# EAGLE design riffleito-REVD (EAGLE 6.5.0)
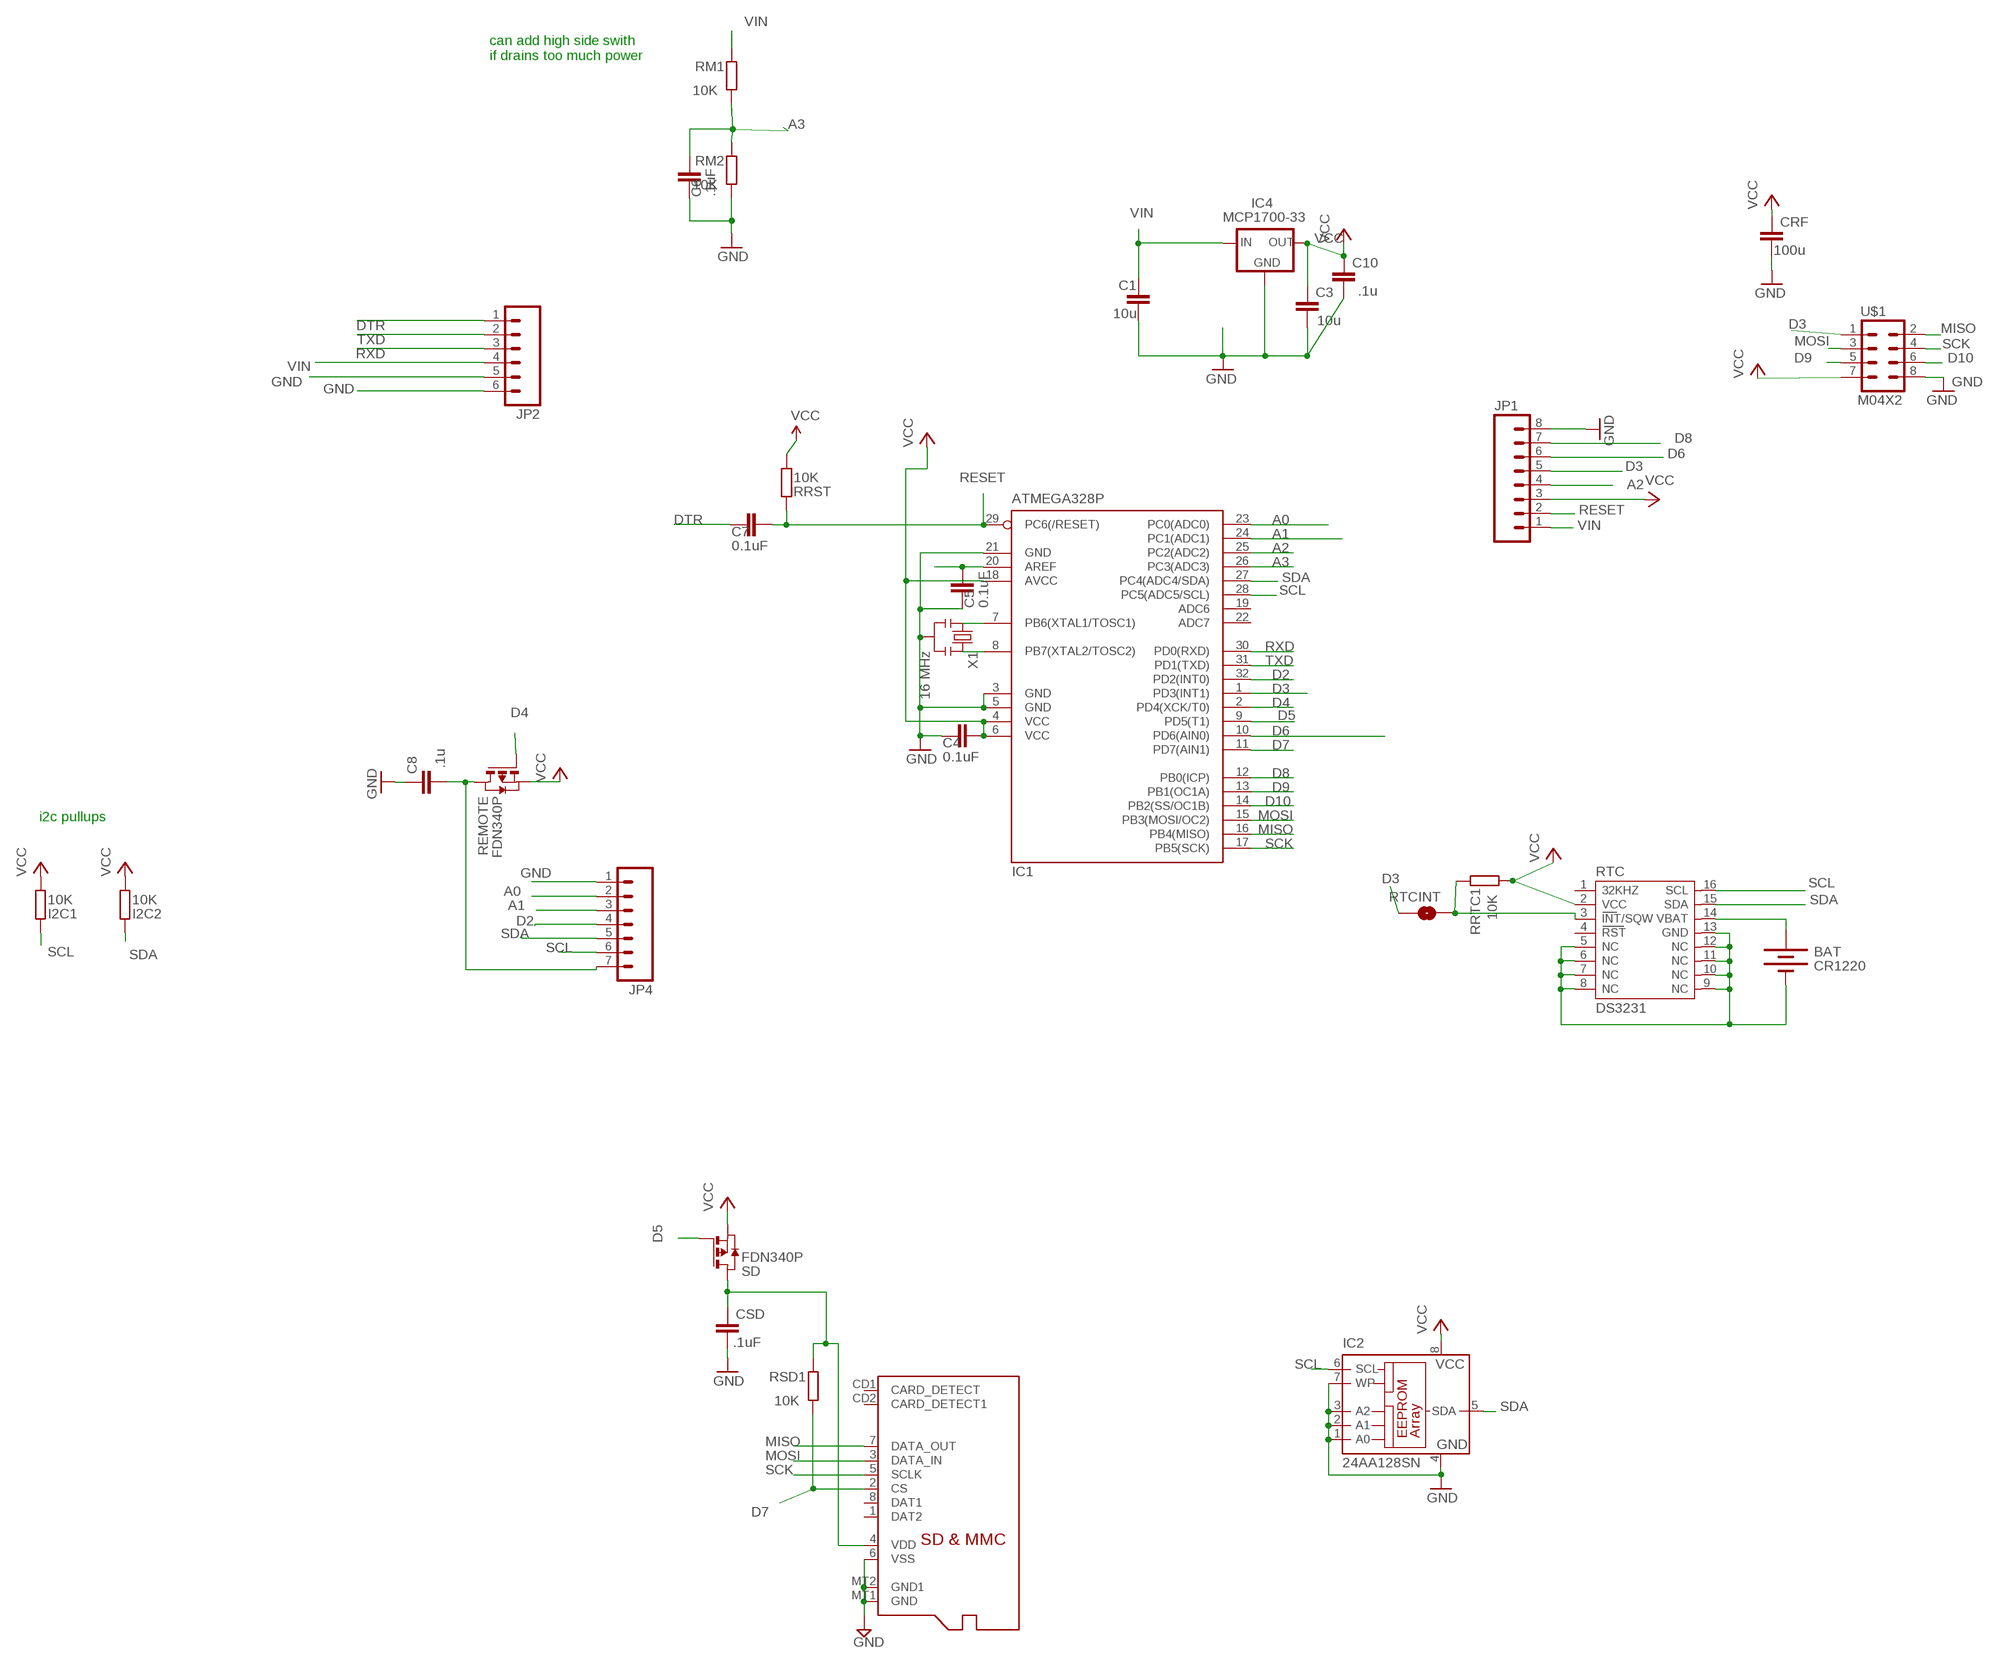
[diagram p0: schematic, sheet 1]

## Parts
BAT  CR1220  BATTERYBATTERY_12MM_SMT  [BATTCON_12MM_SMT]
C1  10u  C-EUC0805  [C0805]
C3  10u  C-EUC0805  [C0805]
C4  0.1uF  C-EUC0805  [C0805@1]
C5  0.1uF  C-EUC0805  [C0805@1]
C6  .1uF  C-EUC0805  [C0805@1]
C7  0.1uF  C-EUC0805  [C0805@1]
C8  .1u  C-EUC0805  [C0805]
C10  .1u  C-EUC0805  [C0805]
CRF  100u  C-EUC0805  [C0805]
CSD  .1uF  C-EUC0805  [C0805]
I2C1  10K  R-EU_R0805  [R0805]
I2C2  10K  R-EU_R0805  [R0805]
IC1  ATMEGA328P  MEGA8-AI  [TQFP32-08]
IC2  24AA128SN  [SO-08]
IC4  MCP1700-33  MCP1700SOT233  [SOT23]
JP1  M081X08  [1X08]
JP2  M06SIP  [1X06]
JP4  M07  [1X07]
MICROSD  MICROSD  [MICROSD]
REMOTE  FDN340P  PMOSSOT23  [SOT-23]
RM1  10K  R-EU_R0805  [R0805]
RM2  10K  R-EU_R0805  [R0805]
RRST  10K  R-EU_R0805  [R0805]
RRTC1  10K  R-EU_R0805  [R0805]
RSD1  10K  R-EU_R0805  [R0805]
RTC  DS3231  [DS3231]
RTCINT  SOLDERJUMPERNO  [SJ_2S-NO]
SD  FDN340P  PMOSSOT23  [SOT-23]
U$1  M04X2  [2X4]
X1  16 MHz  RESONATORSMD  [RESONATOR-SMD]

## Nets
A0: IC1.23(PC0(ADC0)) JP4.2
A1: IC1.24(PC1(ADC1)) JP4.3
A2: IC1.25(PC2(ADC2)) JP1.4
A3: C6.2 IC1.26(PC3(ADC3)) RM1.1 RM2.2
AREF: C5.2 IC1.20(AREF)
D2: IC1.32(PD2(INT0)) JP4.4
D3: IC1.1(PD3(INT1)) JP1.5 RTCINT.2 U$1.1
D4: IC1.2(PD4(XCK/T0)) REMOTE.3(G)
D5: IC1.9(PD5(T1)) SD.3(G)
D6: IC1.10(PD6(AIN0)) JP1.6
D7: IC1.11(PD7(AIN1)) MICROSD.2(CS) RSD1.1
D8: IC1.12(PB0(ICP)) JP1.7
D9: IC1.13(PB1(OC1A)) U$1.5
D10: IC1.14(PB2(SS/OC1B)) U$1.6
DTR: C7.1 JP2.1
GND: BAT.P$1(-) C1.2 C3.2 C4.1 C5.1 C6.1 C8.1 C10.2 CRF.2 CSD.2 IC1.3(GND) IC1.5(GND) IC1.21(GND) IC2.1(A0) IC2.2(A1) IC2.3(A2) IC2.4(GND) IC2.7(WP) IC4.1(GND) JP1.8 JP2.5 JP2.6 JP4.1 MICROSD.6(VSS) MICROSD.MT1(GND) MICROSD.MT2(GND1) RM2.1 RTC.5(NC) RTC.6(NC) RTC.7(NC) RTC.8(NC) RTC.9(NC) RTC.10(NC) RTC.11(NC) RTC.12(NC) RTC.13(GND) U$1.8 X1.2
MISO: IC1.16(PB4(MISO)) MICROSD.7(DATA_OUT) U$1.2
MOSI: IC1.15(PB3(MOSI/OC2)) MICROSD.3(DATA_IN) U$1.3
N$1: RRTC1.2 RTC.3(INT/SQW) RTCINT.1
N$2: IC1.8(PB7(XTAL2/TOSC2)) X1.3
N$3: IC1.7(PB6(XTAL1/TOSC1)) X1.1
N$4: C8.2 JP4.7 REMOTE.1(D)
RESET: C7.2 IC1.29(PC6(/RESET)) JP1.2 RRST.2
RTC_BATT: BAT.P$2(+) RTC.14(VBAT)
RXD: IC1.30(PD0(RXD)) JP2.3
SCK: IC1.17(PB5(SCK)) MICROSD.5(SCLK) U$1.4
SCL: I2C1.2 IC1.28(PC5(ADC5/SCL)) IC2.6(SCL) JP4.6 RTC.16(SCL)
SDA: I2C2.2 IC1.27(PC4(ADC4/SDA)) IC2.5(SDA) JP4.5 RTC.15(SDA)
TXD: IC1.31(PD1(TXD)) JP2.2
VCC: C3.1 C4.2 C10.1 CRF.1 I2C1.1 I2C2.1 IC1.4(VCC) IC1.6(VCC) IC1.18(AVCC) IC2.8(VCC) IC4.2(OUT) JP1.3 REMOTE.2(S) RRST.1 RRTC1.1 RTC.2(VCC) SD.2(S) U$1.7
VDD: CSD.1 MICROSD.4(VDD) RSD1.2 SD.1(D)
VIN [power]: C1.1 IC4.3(IN) JP1.1 JP2.4 RM1.2
Unconnected: IC1.19(ADC6) IC1.22(ADC7) MICROSD.1(DAT2) MICROSD.8(DAT1) MICROSD.CD1(CARD_DETECT) MICROSD.CD2(CARD_DETECT1) RTC.1(32KHZ) RTC.4(RST)

## Notes on the sheet
- can add high side swith
  if drains too much power
- i2c pullups

## Library data of the parts
BAT = SparkFunNew:BATTERY: Battery Holders Various common sizes : AA, AAA, 20mm coin cell and 12mm coin cell.
C1 C3 C8 C10 CRF CSD = resistor:C-EU: CAPACITOR, European symbol
C4-C7 = rcl:C-EU: CAPACITOR, European symbol
I2C1 I2C2 RM1 RM2 RRST RRTC1 RSD1 = rcl:R-EU_: RESISTOR, European symbol
IC1 = atmel:MEGA8: MICROCONTROLLER 8 Kbytes FLASH, 1 kbytes SRAM, 512 bytes EEPROM, USART, 6-channel 10 bit ADC, 2-channel 8 bit ADC Pin compatible with Atmega48, ATMega88, ATMega168 Source: avr.lbr; MPN: ATMEGA8-16AU; OC_FARNELL: 9171371; OC_NEWARK: 73M8863
IC2 = microchip:24*: Serial EEPROM I2C; MF: MICROCHIP; MPN: 24AA128-I/SN; OC_FARNELL: unknown; OC_NEWARK: 92C6842
IC4 = adafruit:MCP1700: VOLTAGE REGULATOR
JP1 = SparkFun-Connectors:M08: Header 8 Standard 8-pin 0.1" header. Use with straight break away headers (SKU : PRT-00116), right angle break away headers (PRT-00553), swiss pins (PRT-00743), machine pins (PRT-00117), and female headers (PRT-00115).
JP2 = SparkFun-Connectors:M06: Header 6 Standard 6-pin 0.1" header. Use with straight break away headers (SKU : PRT-00116), right angle break away headers (PRT-00553), swiss pins (PRT-00743), machine pins (PRT-00117), and female headers (PRT-00115). Molex polarized connector foot print use with SKU : PRT-08094 with associated crimp pins and housings. NOTES ON THE VARIANTS LOCK and LOCK_LONGPADS... This footprint was designed to help hold the alignment of a through-hole component (i.e. 6-pin header) while soldering it into place. You may notice that each hole has been shifted either up or down by 0.005 of an inch from it's more standard position (which is a perfectly straight line). This slight alteration caused the pins (the squares in the middle) to touch the edges of the holes. Because they are alternating, it causes a "brace" to hold the component in place. 0.005 has proven to be the perfect amount of "off-center" position when using our standard breakaway headers. Although looks a little odd when you look at the bare footprint, once you have a header in there, the alteration is very hard to notice. Also,if you push a header all the way into place, it is covered up entirely on the bottom side. This idea of altering the position of holes to aid alignment will be further integrated into the Sparkfun Library for other footprints. It can help hold any component with 3 or more connection pins.
JP4 = SparkFun-Connectors:M07: Header 7 Standard 7-pin 0.1" header. Use with straight break away headers (SKU : PRT-00116), right angle break away headers (PRT-00553), swiss pins (PRT-00743), machine pins (PRT-00117), and female headers (PRT-00115). NOTES ON THE VARIANTS LOCK and LOCK_LONGPADS... This footprint was designed to help hold the alignment of a through-hole component (i.e. 7-pin header) while soldering it into place. You may notice that each hole has been shifted either up or down by 0.005 of an inch from it's more standard position (which is usually a perfectly straight line). This slight alteration caused the pins (the squares in the middle) to touch the edges of the holes. Because they are alternating, it causes a "brace" to hold the header in place. 0.005 has proven to be the perfect amount of "off-center" position when using our standard breakaway headers. Although looks a little odd when you look at the bare footprint, once you have a header in there, the alteration is very hard to notice. Also, if you push a header all the way into place, it is covered up entirely on the bottom side. This idea of altering the position of holes to aid alignment will be further integrated into the Sparkfun Library for other footprints. It can help hold any component with 3 or more connection pins.
MICROSD = adafruit:MICROSD: Micro-SD / Transflash card holder with SPI pinout For the 3M # 2908-05WB-MG and/or 4UCON #19656 push-push type
REMOTE SD = zetex:PMOSSOT23: MOS FET
RTC = _lh-library:DS3231
RTCINT = _SparkFun:SOLDERJUMPER: Solder Jumper Standard SMD solder jumper. Used to automate production. Two varients : Normally Open and Normally Closed are the same, but have different paste layers. NC will have a large amount of paste and should jumper during reflow.
U$1 = SparkFun-Connectors:M04X2: .1" header, two rows of four.
X1 = SparkFun:RESONATOR: Resonator Small SMD resonator. This is the itty bitty 10/20MHz resonators with built in caps. CSTCE10M0G55 and CSTCE20M0V53. Footprint has been reviewed closely but hasn't been tested yet.

## Net classes
0 default: width 0.203 mm, drill 0.33 mm, clearance 0.203 mm
1 power: width 0.381 mm, drill 0.33 mm, clearance 0.254 mm

## Board
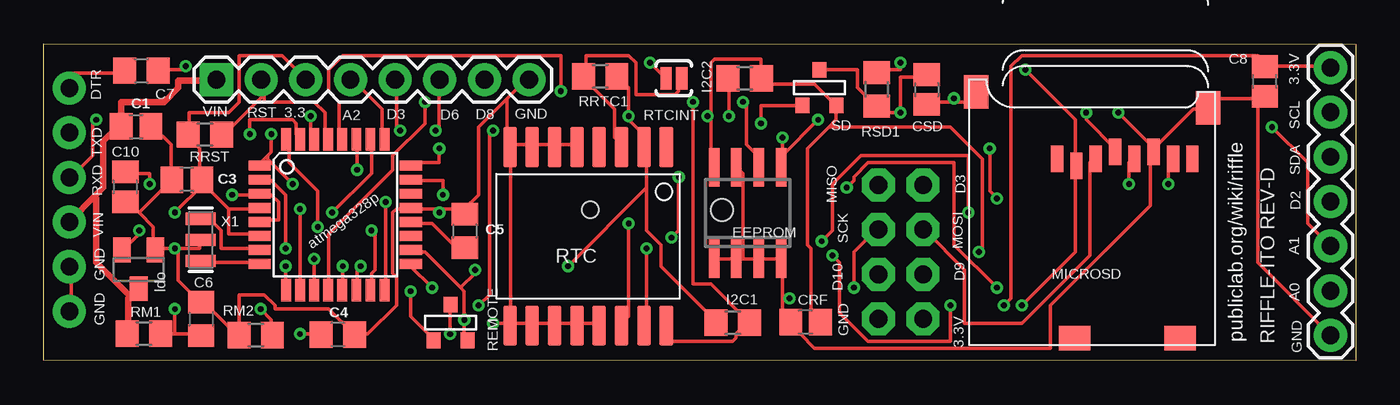
[diagram p1: board, top side]
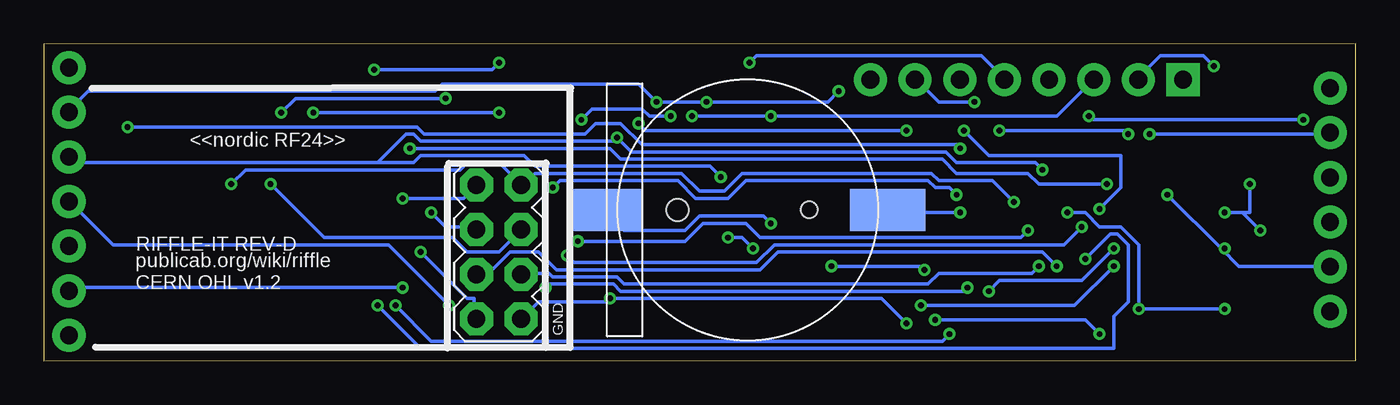
[diagram p2: board, bottom side, seen from below]

Size 74.57 x 18.03 mm. Coordinates in mm from the lower left corner, seen from the top.
Outline: 0,0.03 0,18.03 74.57,18.01 74.57,0 0,0.03
Copper layers (1*16): Top 0.0356mm / dielectric 1.5011mm / Bottom 0.0356mm
Design rules "LaenPCBOrder": minimum track width 6mil, minimum drill 13mil, track to track 6mil, track to pad 6mil, pad to pad 6mil, via to via 6mil, smd to smd 6mil, copper to edge 15mil, drill to drill 6mil, minimum pad ring 7mil, minimum via ring 7mil, stop-mask expansion 3mil, vias tented up to drill 0mil, thermal gap 10mil

### Footprints (pad centres in the part's own frame; a part is rotated, then mirrored left to right if it is on the bottom)
BATTCON_12MM_SMT = smd 2.4 x 4.3: P$1 0,11.96 | smd 2.4 x 4.2: P$2 0,-4.1 | hole 0.95: 0,7.5 | hole 1.25: 0,0
C0805 = smd 1.3 x 1.5: 1 -0.85,0; 2 0.85,0
C0805@1 = smd 1.3 x 1.5: 1 -0.95,0; 2 0.95,0
R0805 = smd 1.3 x 1.5: 1 -0.95,0; 2 0.95,0
TQFP32-08 = smd 1.27 x 0.559: 1 -4.293,2.8; 2 -4.293,2; 3 -4.293,1.2; 4 -4.293,0.4; 5 -4.293,-0.4; 6 -4.293,-1.2; 7 -4.293,-2; 8 -4.293,-2.8; 17 4.293,-2.8; 18 4.293,-2; 19 4.293,-1.2; 20 4.293,-0.4; 21 4.293,0.4; 22 4.293,1.2; 23 4.293,2; 24 4.293,2.8 | smd 0.559 x 1.27: 9 -2.8,-4.293; 10 -2,-4.293; 11 -1.2,-4.293; 12 -0.4,-4.293; 13 0.4,-4.293; 14 1.2,-4.293; 15 2,-4.293; 16 2.8,-4.293; 25 2.8,4.293; 26 2,4.293; 27 1.2,4.293; 28 0.4,4.293; 29 -0.4,4.293; 30 -1.2,4.293; 31 -2,4.293; 32 -2.8,4.293
SO-08 = smd 0.6 x 2.2: 1 -1.905,-2.6; 2 -0.635,-2.6; 3 0.635,-2.6; 4 1.905,-2.6; 5 1.905,2.6; 6 0.635,2.6; 7 -0.635,2.6; 8 -1.905,2.6
SOT23 = smd 1 x 1.4: 1 -0.95,-1.1; 2 0.95,-1.1; 3 0,1.1
1X08 = drill 1.016 pad 1.88 square: 1 0,0 | drill 1.016 pad 1.88: 2 2.54,0; 3 5.08,0; 4 7.62,0; 5 10.16,0; 6 12.7,0; 7 15.24,0; 8 17.78,0
1X06 = drill 1.016 pad 1.88: 1 0,0; 2 2.54,0; 3 5.08,0; 4 7.62,0; 5 10.16,0; 6 12.7,0
1X07 = drill 1.016 pad 1.88: 1 0,0; 2 2.54,0; 3 5.08,0; 4 7.62,0; 5 10.16,0; 6 12.7,0; 7 15.24,0
MICROSD = smd 0.7 x 1.5: 1 9,-10.64; 2 7.9,-10.24; 3 6.8,-10.64; 4 5.7,-11.04; 5 4.6,-10.64; 6 3.5,-11.04; 7 2.4,-10.64; 8 1.3,-10.64 | smd 1.8 x 1.4: CD1 2,-0.44; CD2 8,-0.44 | smd 1.4 x 1.9: MT1 0.4,-13.54; MT2 13.6,-14.44
SOT-23 = smd 0.787 x 0.889: 1 0.025,-1.016; 2 -0.94,1.016; 3 0.991,1.016
DS3231 = smd 0.762 x 2.286: 1 -4.445,-5.08; 2 -3.175,-5.08; 3 -1.905,-5.08; 4 -0.635,-5.08; 5 0.635,-5.08; 6 1.905,-5.08; 7 3.175,-5.08; 8 4.445,-5.08; 9 4.445,5.08; 10 3.175,5.08; 11 1.905,5.08; 12 0.635,5.08; 13 -0.635,5.08; 14 -1.905,5.08; 15 -3.175,5.08; 16 -4.445,5.08
SJ_2S-NO = smd 0.635 x 1.27: 1 -0.45,0; 2 0.45,0
2X4 = drill 1.016 pad 1.88 octagon: 1 -3.81,-1.27; 2 -3.81,1.27; 3 -1.27,-1.27; 4 -1.27,1.27; 5 1.27,-1.27; 6 1.27,1.27; 7 3.81,-1.27; 8 3.81,1.27
RESONATOR-SMD = smd 0.7 x 1.7: 1 -1.2,0; 2 0,0; 3 1.2,0

### Placement (x,y rotation side)
BAT  38.56,8.59 270 bottom
C1  5.23,13.33 0 top
C3  8.13,10.31 180 top
C4  16.71,1.5 180 top
C5  23.93,7.39 270 top
C6  8.94,2.39 270 top
C7  5.54,16.51 0 top
C8  69.42,15.9 90 top
C10  4.62,9.91 270 top
CRF  43.31,2.21 180 top
CSD  50.19,15.44 270 top
I2C1  39.17,2.18 0 top
I2C2  39.85,16.08 180 top
IC1  16.56,8.31 0 top
IC2  40.01,8.41 0 top
IC4  5.38,5.21 180 top
JP1  9.8,16 0 top
JP2  1.45,15.52 270 top
JP4  73.15,1.45 90 top
MICROSD  66.6,0.86 180 top
REMOTE  23.14,2.18 180 top
RM1  5.69,1.55 180 top
RM2  12.04,1.47 0 top
RRST  9.14,12.88 0 top
RRTC1  31.62,16.18 180 top
RSD1  47.35,15.44 270 top
RTC  30.94,7.09 180 top
RTCINT  35.81,16.08 180 top
SD  44.12,15.54 180 top
U$1  48.72,6.2 270 bottom
X1  8.92,6.88 270 top

### Tracks (layer width: path | path; a pad name or v marks a point on that pad's centre or on a via)
A0  (via drill 0.33)
  Top 0.203: v22.68,9.45 22.68,10.26 20.85,10.26 IC1.23 | v45.64,9.86 46.05,10.26 46.05,10.46 46.86,11.28 51.74,11.28 51.74,6.6 v54.18,4.17
  Bottom 0.203: v22.68,9.45 23.09,9.86 23.9,9.86 24.31,10.26 34.67,10.26 35.69,9.25 37.52,9.25 38.53,10.26 45.24,10.26 v45.64,9.86 | v54.18,4.17 73.08,4.17 JP4.2
A1  (via drill 0.33)
  Top 0.203: v22.48,12.09 22.48,11.28 20.85,11.28 IC1.24 | v69.82,13.31 71.86,11.28 71.86,7.82 JP4.3
  Bottom 0.203: v22.48,12.09 22.68,12.29 40.56,12.29 41.78,13.51 43.21,13.51 43.81,12.9 52.96,12.9 53.37,13.31 v69.82,13.31
A2
  Top 0.203: IC1.25 19.23,12.7 19.23,14.33 17.6,15.95 JP1.4
A3  (via drill 0.33)
  Top 0.203: 7.44,1.52 8.86,1.52 C6.2 | 7.44,1.52 6.83,1.52 RM1.1 | v16.38,8.43 18.62,10.67 18.62,12.5 IC1.26 | v12.32,2.95 12.93,2.34 12.93,1.52 RM2.2 | v7.44,2.95 7.44,1.52
  Bottom 0.203: v16.38,8.43 15.37,8.43 14.55,7.62 13.33,7.62 12.32,6.6 v12.32,2.95 v7.44,2.95
AREF
  Top 0.203: IC1.20 20.85,7.82 22.07,7.82 23.29,6.6 23.9,6.6 C5.2
D2  (via drill 0.33)
  Top 0.203: v15.57,7.62 15.57,9.65 13.94,11.28 13.94,12.5 IC1.32 | v44.83,5.99 45.24,5.59 45.24,2.74 46.86,1.12 51.54,1.12 v51.54,3.15
  Bottom 0.203: v15.57,7.62 16.59,6.6 33.05,6.6 34.06,5.59 44.42,5.59 v44.83,5.99 | v51.54,3.15 54.99,6.6 70.64,6.6 73.08,9.04 JP4.4
D3  (via drill 0.33)
  Top 0.203: 12.73,11.68 12.93,11.89 v12.93,12.9 | 12.73,11.68 12.32,11.28 IC1.1 | v20.24,13.11 20.04,13.31 20.04,15.95 JP1.5 | v34.47,16.97 35.28,16.15 RTCINT.2 | v54.18,9.25 53.77,9.65 v53.77,12.09 | v14.15,10.06 12.73,11.48 12.73,11.68
  Bottom 0.203: v12.93,12.9 13.13,13.11 v20.24,13.11 | v34.47,16.97 34.06,17.37 21.26,17.37 20.04,16.15 JP1.5 | v54.18,9.25 50.72,9.25 50.11,9.86 U$1.1 | v53.77,12.09 42.39,12.09 41.78,11.48 23.49,11.48 22.68,10.67 18.62,10.67 18.01,10.06 v14.15,10.06
D4  (via drill 0.33)
  Top 0.203: v20.85,3.96 20.85,2.54 22.07,1.32 REMOTE.3 | v13.74,6.4 13.74,9.45 12.93,10.26 12.32,10.26 IC1.2
  Bottom 0.203: v20.85,3.96 20.24,4.57 15.57,4.57 v13.74,6.4
D5  (via drill 0.33)
  Top 0.203: SD.3 40.77,14.53 v40.77,13.51 | v25.53,13.11 25.32,12.9 25.32,3.76 v24.71,3.15 | v13.74,5.38 13.74,4.17 IC1.9
  Bottom 0.203: v40.77,13.51 40.36,13.11 v25.53,13.11 | v24.71,3.15 15.98,3.15 v13.74,5.38
D6  (via drill 0.33)
  Top 0.203: v14.55,8.64 14.55,4.17 IC1.10 | v22.28,13.11 22.48,13.31 22.48,15.95 JP1.6
  Bottom 0.203: v14.55,8.64 13.33,9.86 13.33,11.68 20.85,11.68 v22.28,13.11
D7  (via drill 0.33)
  Top 0.203: v15.37,5.79 15.37,4.17 IC1.11 | v55.6,3.15 58.65,6.2 58.65,11.07 MICROSD.2 58.65,11.28 58.65,13.72 v55.8,16.56 | v48.69,16.97 48.69,16.56 47.47,16.56 RSD1.1
  Bottom 0.203: v15.37,5.79 13.94,7.21 13.54,7.21 12.93,6.6 12.93,3.35 13.74,2.54 13.74,0.71 53.16,0.71 v55.6,3.15 | v48.69,16.97 49.1,16.56 v55.8,16.56
D8  (via drill 0.33)
  Top 0.203: v21.67,14.73 21.67,13.51 19.84,11.68 19.84,10.87 16.18,7.21 16.18,4.17 IC1.12
  Bottom 0.203: v21.67,14.73 23.7,14.73 24.92,15.95 JP1.7
D9  (via drill 0.33)
  Top 0.203: v16.99,5.38 16.99,4.17 IC1.13
  Bottom 0.203: v16.99,5.38 17.81,6.2 32.84,6.2 33.86,5.18 45.44,5.18 46.46,6.2 48.08,6.2 49.3,4.98 49.91,4.98 U$1.5
D10  (via drill 0.33)
  Top 0.203: v18.01,5.38 17.81,5.18 17.81,4.17 IC1.14
  Bottom 0.203: v18.01,5.38 18.41,4.98 23.7,4.98 24.31,4.37 41.58,4.37 41.99,4.78 45.64,4.78 45.85,4.98 47.27,4.98 U$1.6
DTR
  Top 0.203: C7.1 4.39,16.36 1.55,16.36 1.55,15.54 JP2.1
GND  (via drill 0.33)
  Top 0.203: 27.76,2.13 26.54,2.13 | RTC.13 31.42,2.13 30.4,2.13 RTC.12 30.2,2.13 29.18,2.13 RTC.11 28.98,2.13 27.76,2.13 | 27.76,2.13 RTC.10 | 27.76,12.29 26.54,12.29 RTC.8 | RTC.5 30.2,12.29 29.18,12.29 RTC.6 28.98,12.29 27.76,12.29 | 27.76,12.29 RTC.7 | 20.85,8.84 IC1.21 20.85,8.64 | 23.9,8.64 22.48,8.64 | 22.48,8.64 20.85,8.64 | 23.9,8.64 23.9,8.43 C5.1 23.9,8.64 | 23.9,8.64 24.71,9.45 24.71,13.31 26.34,14.94 | 26.34,14.94 27.56,16.15 JP1.8 | 26.34,14.94 26.34,12.29 RTC.8 | 26.54,2.13 26.54,12.09 RTC.8 | 26.54,2.13 RTC.9 26.34,2.13 v25.53,2.13 | 22.48,8.64 v22.48,8.43 | IC1.5 12.32,8.03 13.33,8.03 13.33,9.04 12.93,9.45 12.32,9.45 IC1.3 12.12,9.45 v10.69,9.45 | JP2.6 1.55,2.95 1.55,5.18 JP2.5 | 7.65,6.4 8.86,6.4 8.86,6.81 X1.2 | 7.65,6.4 v7.44,6.4 6.43,6.4 IC4.1 6.22,6.4 6.22,7.62 5.41,8.43 | 5.41,8.43 4.8,9.04 C10.2 | 5.41,8.43 7.24,10.26 C3.2 7.24,10.46 7.24,12.29 6.22,13.31 C1.2 | 7.65,6.4 7.65,4.57 8.86,3.35 C6.1 9.07,3.35 10.9,1.52 RM2.1 11.1,1.52 11.1,3.76 12.52,3.76 13.13,3.15 13.13,2.95 16.18,2.95 17.6,1.52 C4.1 17.81,1.52 18.41,1.52 20.04,3.15 20.04,4.78 19.84,4.98 19.84,8.43 20.04,8.64 20.85,8.64 | 41.99,3.56 41.99,5.79 IC2.4 41.78,5.79 40.77,5.79 IC2.3 40.56,5.79 39.75,5.79 | 41.99,3.56 41.99,2.74 42.39,2.34 CRF.2 42.6,2.13 43,1.73 43,1.52 43.81,0.71 57.23,0.71 57.23,3.15 62.92,8.84 62.92,11.89 MICROSD.6 | IC2.1 38.13,5.79 39.34,5.79 IC2.2 39.55,5.79 39.75,5.79 | 39.75,5.79 39.75,10.67 39.55,10.87 IC2.7 | 41.99,3.56 v42.39,3.56 | 51.74,14.73 52.96,14.73 52.96,15.14 MICROSD.MT2 | 51.74,14.73 50.32,14.73 CSD.2 | MICROSD.6 63.12,12.09 65.35,14.33 66.17,14.33 MICROSD.MT1 66.37,14.53 66.37,14.94 69.01,14.94
  Top 0.203: v51.74,14.94 51.74,14.73 | v61.09,14.12 62.92,12.29 62.92,12.09 MICROSD.6 | JP4.1 69.01,5.59 69.01,14.94 | 69.01,14.94 C8.1
  Bottom 0.203: v22.48,8.43 26.54,8.43 BAT.P$1 | 7.65,6.4 6.63,5.38 1.55,5.38 JP2.5 | 7.65,6.4 v10.69,9.45 | v7.44,6.4 7.65,6.4 | U$1.8 47.27,2.54 46.46,3.35 42.6,3.35 v42.39,3.56 26.95,3.56 v25.53,2.13 | v51.74,14.94 60.27,14.94 v61.09,14.12
MISO  (via drill 0.33)
  Top 0.203: v19.43,9.04 19.43,4.17 IC1.16 | v63.93,10.06 63.93,11.28 64.13,11.48 MICROSD.7
  Bottom 0.203: v19.43,9.04 20.65,10.26 23.7,10.26 24.1,10.67 34.87,10.67 35.89,9.65 37.31,9.65 38.33,10.67 46.66,10.67 47.27,10.06 U$1.2 47.47,10.06 48.69,11.28 50.52,11.28 50.93,10.87 63.12,10.87 v63.93,10.06
MOSI  (via drill 0.33)
  Top 0.203: v18.62,7.42 18.82,7.21 18.82,5.18 18.62,4.98 18.62,4.17 IC1.15 | v44.22,6.81 44.83,7.42 44.83,10.06 46.46,11.68 52.55,11.68 v52.55,8.43 | MICROSD.3 59.66,11.48 59.46,11.28 59.46,5.99 55.6,2.13 52.35,2.13 52.35,5.18 50.11,7.42 U$1.3
  Bottom 0.203: v18.62,7.42 19.02,7.01 33.86,7.01 34.67,7.82 37.11,7.82 38.13,6.81 v44.22,6.81 | v52.55,8.43 51.74,7.62 50.11,7.62 U$1.3
N$1
  Top 0.203: RTCINT.1 36.09,15.95 36.09,15.34 35.89,15.14 33.65,15.14 33.65,16.97 33.25,17.37 30.81,17.37 30.81,16.36 RRTC1.2 30.81,16.15 30.81,15.95 32.44,14.33 32.44,12.7 32.84,12.29 RTC.3
N$2
  Top 0.203: IC1.8 12.12,5.59 9.07,5.59 X1.3
N$3
  Top 0.203: IC1.7 12.12,6.4 10.08,6.4 10.08,7.42 9.47,8.03 9.07,8.03 X1.1
N$4  (via drill 0.33)
  Top 0.203: v23.09,1.52 23.09,3.15 REMOTE.1 | v54.58,3.15 54.99,3.56 54.99,16.76 55.6,17.37 69.01,17.37 69.39,16.76 | 69.39,16.76 73.08,16.76 JP4.7 | 69.39,16.76 C8.2
  Bottom 0.203: v23.09,1.52 23.49,1.12 52.55,1.12 v54.58,3.15
RESET  (via drill 0.33)
  Top 0.203: 12.52,15.14 12.52,15.95 JP1.2 12.52,15.14 | 12.52,15.14 12.52,14.73 15.37,14.73 15.98,14.12 15.98,12.7 IC1.29 | 12.52,15.14 10.29,12.9 RRST.2 | v8.05,16.76 8.05,16.56 6.63,16.56 C7.2
  Bottom 0.203: v8.05,16.76 8.66,17.37 11.1,17.37 12.32,16.15 JP1.2
RTC_BATT  (via drill 0.33)
  Top 0.203: v33.25,7.82 33.25,2.54 32.84,2.13 RTC.14
  Bottom 0.203: v33.25,7.82 33.65,8.23 37.31,8.23 38.13,7.42 41.58,7.42 42.6,8.43 BAT.P$2
RXD  (via drill 0.33)
  Top 0.203: v15.16,13.92 15.16,12.7 IC1.30 | v2.97,13.72 2.77,13.51 2.77,11.68 1.55,10.46 JP2.3
  Bottom 0.203: v15.16,13.92 14.96,13.72 v2.97,13.72
SCK  (via drill 0.33)
  Top 0.203: v22.07,4.17 20.85,5.38 IC1.17 | v46.05,4.17 46.05,6.2 47.27,7.42 U$1.4 | v61.7,10.06 61.7,11.28 61.9,11.48 MICROSD.5
  Bottom 0.203: v22.07,4.17 22.28,3.96 41.78,3.96 42.19,4.37 45.85,4.37 v46.05,4.17 | v61.7,10.06 58.65,7.01 51.33,7.01 50.52,6.2 48.69,6.2 47.47,7.42 U$1.4
SCL  (via drill 0.33)
  Top 0.203: RTC.16 35.48,1.93 35.48,1.12 39.14,1.12 39.34,1.32 39.34,1.52 39.95,2.13 I2C1.2 39.95,2.34 37.92,4.37 36.91,4.37 v36.91,14.73 | v29.39,15.34 29.39,17.37 16.99,17.37 16.18,16.56 16.18,15.34 16.79,14.73 16.79,12.7 IC1.28 | v39.75,14.73 39.95,14.53 39.95,12.29 40.56,11.68 40.56,11.07 IC2.6
  Bottom 0.203: v29.39,15.34 30,14.73 v36.91,14.73 v39.75,14.73 40.77,15.75 51.94,15.75 52.35,15.34 72.06,15.34 73.08,14.33 JP4.6
SDA  (via drill 0.33)
  Top 0.203: v17.81,10.87 17.81,12.5 IC1.27 | 41.99,11.68 41.99,11.07 IC2.5 41.99,11.68 | 41.99,11.68 v41.99,12.7 | v38.94,13.92 38.94,15.95 I2C2.2 | 41.99,11.68 v44.02,13.72 | v34.26,6.4 34.26,2.13 RTC.15 | v35.69,7.01 36.09,7.42 v36.09,10.46
  Bottom 0.203: v17.81,10.87 18.21,11.28 22.68,11.28 23.29,11.89 41.17,11.89 v41.99,12.7 42.19,12.5 53.16,12.5 53.57,12.9 53.97,12.9 55.6,11.28 | v38.94,13.92 40.16,13.92 40.56,14.33 43.41,14.33 v44.02,13.72 | v34.26,6.4 34.87,7.01 v35.69,7.01 | v36.09,10.46 36.7,11.07 46.66,11.07 47.27,11.68 53.16,11.68 53.57,11.28 55.6,11.28 | 55.6,11.28 72.87,11.28 73.08,11.48 JP4.5
TXD  (via drill 0.33)
  Top 0.203: v11.71,12.9 11.71,13.72 14.15,13.72 14.35,13.51 14.35,12.9 14.55,12.7 IC1.31
  Bottom 0.203: v11.71,12.9 1.55,12.9 JP2.2
VCC  (via drill 0.33)
  Top 0.203: 38.13,11.07 IC2.8 37.92,11.07 37.92,13.92 | 45.03,14.53 43.81,15.75 40.97,15.75 40.97,15.95 I2C2.1 40.77,16.15 40.77,17.17 38.13,17.17 37.92,16.97 37.92,13.92 | 44.63,13.31 45.03,13.72 45.03,14.53 | 44.63,13.31 43.41,12.09 43.41,6.6 43.61,6.4 43.61,2.74 44.02,2.34 CRF.1 | 45.03,14.53 SD.2 | v53.16,6.2 53.37,6.4 53.37,11.48 51.54,13.31 44.63,13.31 | 10.49,8.64 10.49,7.21 12.12,7.21 IC1.6 | 9.07,10.06 10.49,8.64 | 9.07,10.06 9.07,10.26 C3.1 | 10.49,8.64 12.12,8.64 IC1.4 | v5.41,7.42 5.41,7.21 4.6,6.4 IC4.2 | 9.07,10.06 v7.44,8.43 | 9.07,10.06 C3.1 | v6.02,10.06 6.02,10.67 4.8,10.67 C10.1 | C3.1 8.86,10.46 8.86,12.09 8.25,12.7 RRST.1 8.25,12.9 8.25,14.12 10.49,14.12 11.1,14.73 11.1,17.37 13.54,17.37 14.76,16.15 JP1.3 | 23.7,4.17 21.67,6.2 20.85,6.2 IC1.18 | 23.7,4.17 23.9,3.96 v23.9,2.34 23.9,1.32 REMOTE.2 | v14.55,1.52 15.57,1.52 C4.2 | 34.26,9.86 34.26,12.09 RTC.2 34.06,12.29 34.06,12.9 33.25,13.72 v33.25,13.92 33.25,15.54 32.64,16.15 RRTC1.1 | 34.26,9.86 34.26,7.42 35.08,6.6 35.08,5.38 38.13,2.34 I2C1.1 | 23.7,4.17 24.51,4.98 v24.51,5.18 | 34.26,9.86 v29.79,5.38 | v37.72,13.92 37.92,13.92
  Bottom 0.203: v53.16,6.2 50.52,3.56 50.11,3.56 50.11,2.54 U$1.7 | 6.43,8.43 v5.41,7.42 | v7.44,8.43 6.43,8.43 | v6.02,10.06 6.02,8.43 6.43,8.43 | v14.55,1.52 15.37,2.34 v23.9,2.34 | v24.51,5.18 24.71,5.38 v29.79,5.38 | JP1.3 14.96,15.95 16.99,13.92 v33.25,13.92 v37.72,13.92
VDD  (via drill 0.33)
  Top 0.203: SD.1 46.25,16.56 46.25,15.54 47.27,14.53 RSD1.2 47.47,14.33 47.47,14.12 v48.69,14.12 48.69,16.15 50.11,16.15 CSD.1 | v59.26,14.12 59.26,13.72 60.88,12.09 MICROSD.4
  Bottom 0.203: v48.69,14.12 v59.26,14.12
VIN
  Top 0.381: 4.9,3.66 4.8,3.56 4.8,1.73 RM1.2 | 4.9,3.66 5.21,3.96 IC4.3 | 2.87,9.35 1.55,8.03 JP2.4 | 2.87,9.35 3.38,9.86 3.38,12.5 4.19,13.31 C1.1 4.39,13.51 4.39,14.73 6.83,14.73 7.65,15.54 7.65,15.95 9.68,15.95 JP1.1 | 4.9,3.66 2.97,5.59 2.97,9.25 2.87,9.35

### Text on the board
tPlace: 3.3V | DTR | SCL | VIN | RST | 3.3 | A2 | D3 | D6 | D8 | GND | SDA | TXD | MISO | D3 | atmega328p | D2 | RXD | SCK | MOSI | VIN | EEPROM | A1 | D9 | ldo | D10 | GND | A0 | GND | GND | 3.3V | GND | publiclab.org/wiki/riffle | RIFFLE-ITO REV-D
bPlace: <<nordic RF24>> | RIFFLE-IT REV-D | publicab.org/wiki/riffle | CERN OHL v1.2 | GND